# Altium schematic sheet Dust1_MotherBoard_MCU.SchDoc
size A4; SheetNumber: 2; SheetTotal: 5
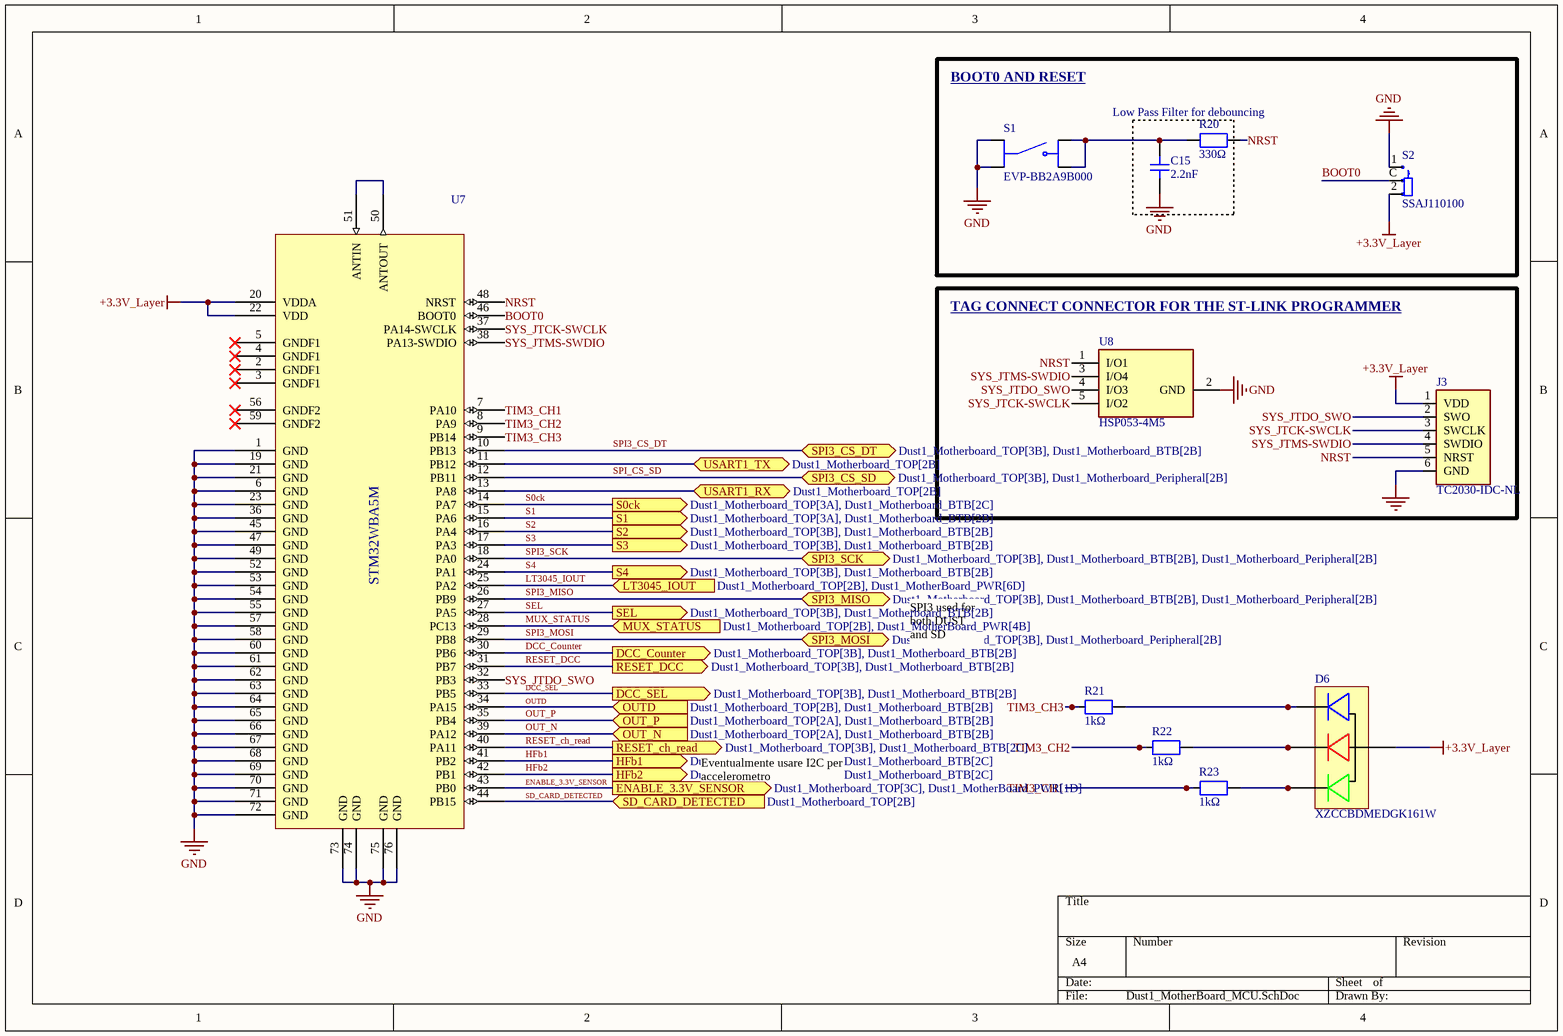
[diagram p0: Dust1_MotherBoard_MCU.SchDoc]

## Parts
C15  2.2nF  [CAP_0402]
D6  XZCCBDMEDGK161W  [PCBComponent_1]
J3  TC2030-IDC-NL  [TAG_TC2030-IDC-NL]
R20  330Ω  [RES_0402]
R21  1kΩ  [RES_0402]
R22  1kΩ  [RES_0402]
R23  1kΩ  [RES_0402]
S1  EVP-BB2A9B000  [SW_EVP-BB2A9B000]
S2  SSAJ110100  [SW_SSAJ110100]
U7  STM32WBA5MMG  [LGA76_stm32wba5mmg_C50P9X9_800X1250X137]  (value not drawn)
U8  HSP053-4M5  [HSP0534M5]

## Blocks framed on the sheet
BOOT0 AND RESET: C15 R20 S1 S2
TAG CONNECT CONNECTOR FOR THE ST-LINK PROGRAMMER: J3 U8

## Ports
DCC_Counter (out, see Dust1_Motherboard_TOP[3B], Dust1_Motherboard_BTB[2B]), DCC_SEL (out, see Dust1_Motherboard_TOP[3B], Dust1_Motherboard_BTB[2B]), ENABLE_3.3V_SENSOR (out, see Dust1_Motherboard_TOP[3C], Dust1_MotherBoard_PWR[1D]), HFb1 (out, see Dust1_Motherboard_TOP[3B], Dust1_Motherboard_BTB[2C]), HFb2 (out, see Dust1_Motherboard_TOP[3B], Dust1_Motherboard_BTB[2C]), LT3045_IOUT (in, see Dust1_Motherboard_TOP[2B], Dust1_MotherBoard_PWR[6D]), MUX_STATUS (in, see Dust1_Motherboard_TOP[2B], Dust1_MotherBoard_PWR[4B]), OUT_N (in, see Dust1_Motherboard_TOP[2A], Dust1_Motherboard_BTB[2B]), OUT_P (in, see Dust1_Motherboard_TOP[2A], Dust1_Motherboard_BTB[2B]), OUTD (in, see Dust1_Motherboard_TOP[2B], Dust1_Motherboard_BTB[2B]), RESET_ch_read (out, see Dust1_Motherboard_TOP[3B], Dust1_Motherboard_BTB[2C]), RESET_DCC (out, see Dust1_Motherboard_TOP[3B], Dust1_Motherboard_BTB[2B]), S0ck (out, see Dust1_Motherboard_TOP[3A], Dust1_Motherboard_BTB[2C]), S1 (out, see Dust1_Motherboard_TOP[3A], Dust1_Motherboard_BTB[2B]), S2 (out, see Dust1_Motherboard_TOP[3B], Dust1_Motherboard_BTB[2B]), S3 (out, see Dust1_Motherboard_TOP[3B], Dust1_Motherboard_BTB[2B]), S4 (out, see Dust1_Motherboard_TOP[3B], Dust1_Motherboard_BTB[2B]), SD_CARD_DETECTED (in, see Dust1_Motherboard_TOP[2B]), SEL (out, see Dust1_Motherboard_TOP[3B], Dust1_Motherboard_BTB[2B]), SPI3_CS_DT (bidir, see Dust1_Motherboard_TOP[3B], Dust1_Motherboard_BTB[2B]), SPI3_CS_SD (bidir, see Dust1_Motherboard_TOP[3B], Dust1_Motherboard_Peripheral[2B]), SPI3_MISO (bidir, see Dust1_Motherboard_TOP[3B], Dust1_Motherboard_BTB[2B], Dust1_Motherboard_Peripheral[2B]), SPI3_MOSI (bidir, see Dust1_Motherboard_TOP[3B], Dust1_Motherboard_Peripheral[2B]), SPI3_SCK (bidir, see Dust1_Motherboard_TOP[3B], Dust1_Motherboard_BTB[2B], Dust1_Motherboard_Peripheral[2B]), USART1_RX (bidir, see Dust1_Motherboard_TOP[2B]), USART1_TX (bidir, see Dust1_Motherboard_TOP[2B])

## Nets
+3.3V_Layer: D6.2 J3.1(VDD) S2.2 U7.20(VDDA) U7.22(VDD)
GND: C15.1 J3.6(GND) S1.A1 S1.A2 S2.1 U7.1(GND) U7.6(GND) U7.19(GND) U7.21(GND) U7.23(GND) U7.36(GND) U7.45(GND) U7.47(GND) U7.49(GND) U7.52(GND) U7.53(GND) U7.54(GND) U7.55(GND) U7.57(GND) U7.58(GND) U7.60(GND) U7.61(GND) U7.62(GND) U7.63(GND) U7.64(GND) U7.65(GND) U7.66(GND) U7.67(GND) U7.68(GND) U7.69(GND) U7.70(GND) U7.71(GND) U7.72(GND) U7.73(GND) U7.74(GND) U7.75(GND) U7.76(GND) U8.2(GND)
BOOT0: S2.C U7.46(BOOT0)
DCC_Counter: U7.30(PB6) ; port DCC_Counter
DCC_SEL: U7.33(PB5) ; port DCC_SEL
ENABLE_3.3V_SENSOR: U7.43(PB0) ; port ENABLE_3.3V_SENSOR
HFb1: U7.41(PB2) ; port HFb1
HFb2: U7.42(PB1) ; port HFb2
LT3045_IOUT: U7.25(PA2) ; port LT3045_IOUT
MUX_STATUS: U7.28(PC13) ; port MUX_STATUS
NRST: J3.5(NRST) R20.2 U7.48(NRST) U8.1(I/O1)
OUT_N: U7.39(PA12) ; port OUT_N
OUT_P: U7.35(PB4) ; port OUT_P
OUTD: U7.34(PA15) ; port OUTD
RESET_ch_read: U7.40(PA11) ; port RESET_ch_read
RESET_DCC: U7.31(PB7) ; port RESET_DCC
S0ck: U7.14(PA7) ; port S0ck
S1: U7.15(PA6) ; port S1
S2: U7.16(PA4) ; port S2
S3: U7.17(PA3) ; port S3
S4: U7.24(PA1) ; port S4
SD_CARD_DETECTED: U7.44(PB15) ; port SD_CARD_DETECTED
SEL: U7.27(PA5) ; port SEL
SPI3_CS_DT: U7.10(PB13) ; port SPI3_CS_DT
SPI3_MISO: U7.26(PB9) ; port SPI3_MISO
SPI3_MOSI: U7.29(PB8) ; port SPI3_MOSI
SPI3_SCK: U7.18(PA0) ; port SPI3_SCK
SPI_CS_SD: U7.12(PB11) ; port SPI3_CS_SD
SYS_JTCK-SWCLK: J3.3(SWCLK) U7.37(PA14-SWCLK) U8.5(I/O2)
SYS_JTDO_SWO: J3.2(SWO) U7.32(PB3) U8.4(I/O3)
SYS_JTMS-SWDIO: J3.4(SWDIO) U7.38(PA13-SWDIO) U8.3(I/O4)
TIM3_CH1: R23.1 U7.7(PA10)
TIM3_CH2: R22.1 U7.8(PA9)
TIM3_CH3: R21.1 U7.9(PB14)
USART1_RX: U7.13(PA8) ; port USART1_RX
USART1_TX: U7.11(PB12) ; port USART1_TX
NetC15_2: C15.2 R20.1 S1.B1 S1.B2
NetD6_1: D6.1 R21.2
NetD6_3: D6.3 R22.2
NetD6_4: D6.4 R23.2
NetU7_50: U7.50(ANTOUT) U7.51(ANTIN)

Not connected (* = marked no-connect by the designer): U7 2(GNDF1)* 3(GNDF1)* 4(GNDF1)* 5(GNDF1)* 56(GNDF2)* 59(GNDF2)*

## Notes on the sheet
- (near R20) Low Pass Filter for debouncing
- SPI3 used for both DUST and SD
- Eventualmente usare I2C per accelerometro
- (in symbol CMP-00014-5) STM32WBA5M

## Library data of the parts
C15 = CMP-001-00099-2: Generic 0402 Capacitor; Design Item ID: CAP_0402; Source: CAP_0402.SchLib
D6 = CMP-007-00036-1: Source: XZCCBDMEDGK161W.SchLib; Design Item ID: XZCCBDMEDGK161W
J3 = CMP-00019-5: CABLE ADAPTER 6 POS; Component Type: Standard; Design Item ID: TC2030-IDC-NL; Package: None; MP: TC2030-IDC-NL; Value: *; Pin Count: 6; Source: TC2030-IDC-NL.SchLib; Availability: Unavailable; Price: None
R20-R23 = CMP-009-00192-1: Resistor SMD 0402 Generic; Design Item ID: RES_0402; Source: RES_0402.SchLib
S1 = CMP-011-00022-2: Tactile Switch SPST-NO Top Actuated Surface Mount; MF: Panasonic Electronic Components; SnapEDA_Link: https://www.snapeda.com/parts/EVP-BB2A9B000/Panasonic+Electronic+Components/view-part/?ref=snap; Pins: 4; Value: *; Design Item ID: EVP-BB2A9B000; Check_prices: https://www.snapeda.com/parts/EVP-BB2A9B000/Panasonic+Electronic+Components/view-part/?ref=eda; Case/Package: None; MP: EVP-BB2A9B000; Component Type: Standard; Source: EVP-BB2A9B000.SchLib
S2 = CMP-011-00025-3: Slide Switch â€¢ Rating (max.): 10 mA 5 VDC â€¢ Poles: 1 â€¢ Positions: 2 â€¢ Travel : 1.4 mm â€¢ Operating direction: Horizontal; MF: ALPS; Source: SSAJ110100.SchLib; MP: SSAJ110100; Case/Package: None; Availability: In Stock; Value: *; Purchase-URL: https://pricing.snapeda.com/search/part/SSAJ110100/?ref=eda; Component Type: Standard; Design Item ID: SSAJ110100; Check_prices: https://www.snapeda.com/parts/SSAJ110100/ALPS/view-part/?ref=eda; Price: None; Pins: 3; SnapEDA_Link: https://www.snapeda.com/parts/SSAJ110100/ALPS/view-part/?ref=snap
U7 = CMP-00014-5: Bluetooth LE and IEEE 802.15.4 radio module
U8 = CMP-004-00039-6: Clamp Ipp Tvs Diode Surface Mount 5-uQFN (1.3x0.8); Manufacturer_Name: STMicroelectronics; Geometry.Height: 0.4mm; Source: HSP053-4M5.SchLib; Design Item ID: HSP053-4M5; Mouser Price/Stock: https://www.mouser.co.uk/ProductDetail/STMicroelectronics/HSP053-4M5?qs=lYGu3FyN48c0CphNYEE2iw%3D%3D; Mouser Part Number: 511-HSP053-4M5; Datasheet Link: https://www.st.com/resource/en/datasheet/hsp051-4m5.pdf; Manufacturer_Part_Number: HSP053-4M5